# Altium schematic sheet Digital_Testbed.SchDoc
size A4; SheetNumber: 1; SheetTotal: 4
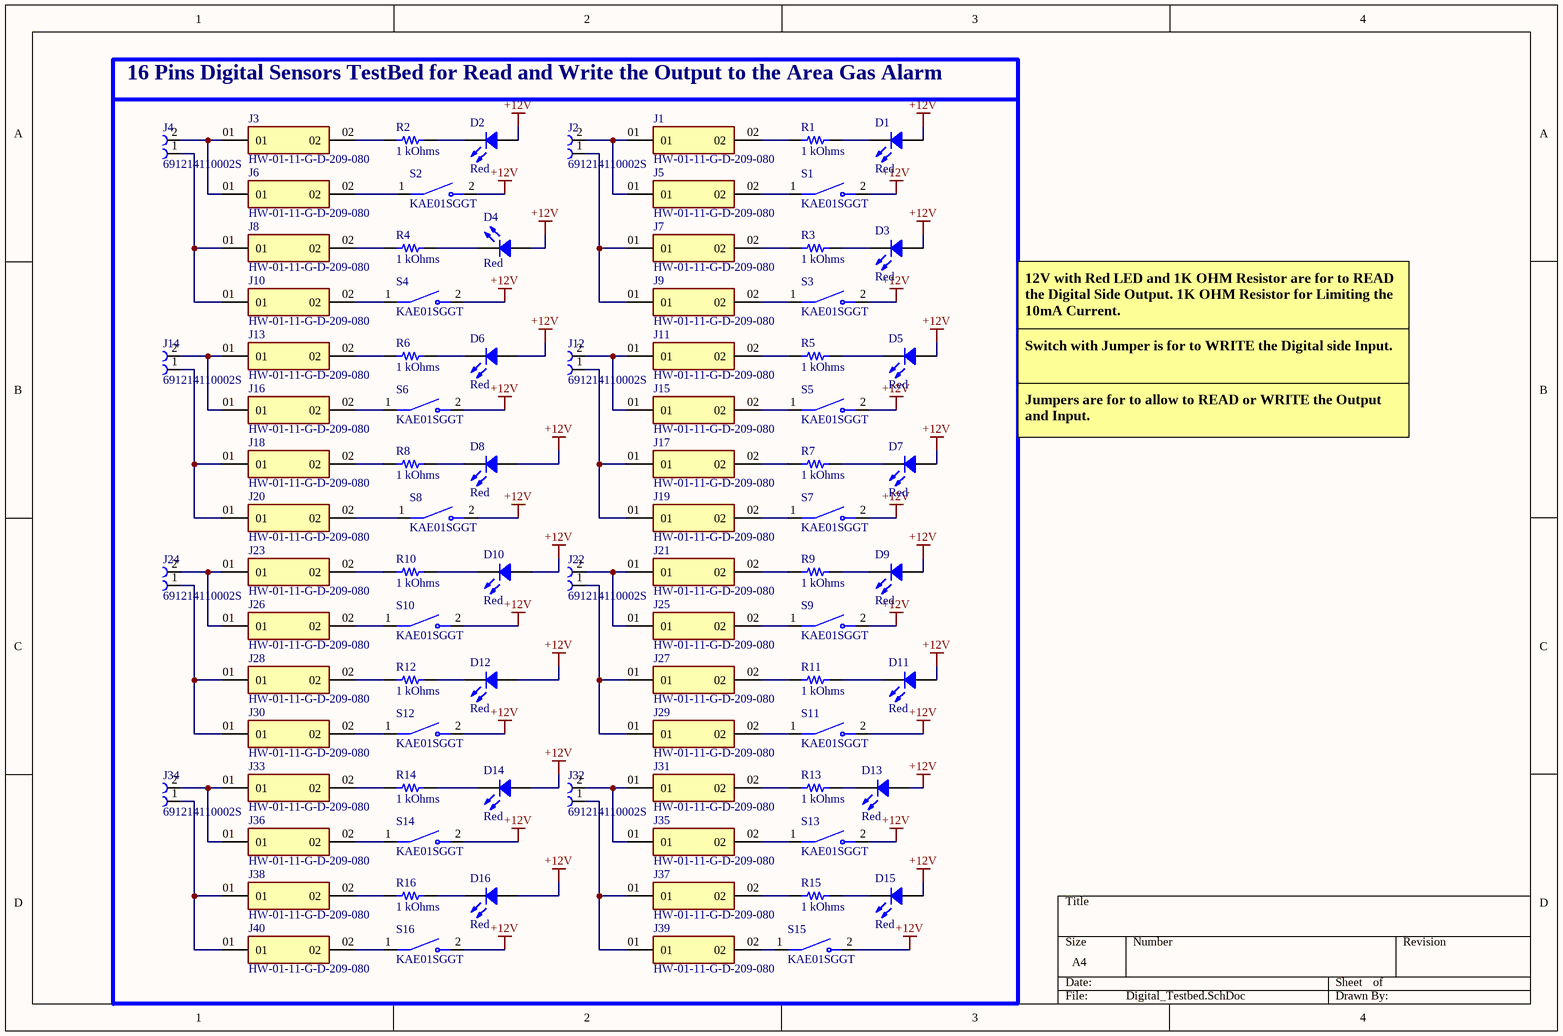
[diagram p0: Digital_Testbed.SchDoc]

## Parts
D1  Red  [LED 0603_1608 RED]
D2  Red  [LED 0603_1608 RED]
D3  Red  [LED 0603_1608 RED]
D4  Red  [LED 0603_1608 RED]
D5  Red  [LED 0603_1608 RED]
D6  Red  [LED 0603_1608 RED]
D7  Red  [LED 0603_1608 RED]
D8  Red  [LED 0603_1608 RED]
D9  Red  [LED 0603_1608 RED]
D10  Red  [LED 0603_1608 RED]
D11  Red  [LED 0603_1608 RED]
D12  Red  [LED 0603_1608 RED]
D13  Red  [LED 0603_1608 RED]
D14  Red  [LED 0603_1608 RED]
D15  Red  [LED 0603_1608 RED]
D16  Red  [LED 0603_1608 RED]
J1  HW-01-11-G-D-209-080  [SAMTEC_HW-01-11-G-D-209-080]
J2  691214110002S  [691214110002S]
J3  HW-01-11-G-D-209-080  [SAMTEC_HW-01-11-G-D-209-080]
J4  691214110002S  [691214110002S]
J5  HW-01-11-G-D-209-080  [SAMTEC_HW-01-11-G-D-209-080]
J6  HW-01-11-G-D-209-080  [SAMTEC_HW-01-11-G-D-209-080]
J7  HW-01-11-G-D-209-080  [SAMTEC_HW-01-11-G-D-209-080]
J8  HW-01-11-G-D-209-080  [SAMTEC_HW-01-11-G-D-209-080]
J9  HW-01-11-G-D-209-080  [SAMTEC_HW-01-11-G-D-209-080]
J10  HW-01-11-G-D-209-080  [SAMTEC_HW-01-11-G-D-209-080]
J11  HW-01-11-G-D-209-080  [SAMTEC_HW-01-11-G-D-209-080]
J12  691214110002S  [691214110002S]
J13  HW-01-11-G-D-209-080  [SAMTEC_HW-01-11-G-D-209-080]
J14  691214110002S  [691214110002S]
J15  HW-01-11-G-D-209-080  [SAMTEC_HW-01-11-G-D-209-080]
J16  HW-01-11-G-D-209-080  [SAMTEC_HW-01-11-G-D-209-080]
J17  HW-01-11-G-D-209-080  [SAMTEC_HW-01-11-G-D-209-080]
J18  HW-01-11-G-D-209-080  [SAMTEC_HW-01-11-G-D-209-080]
J19  HW-01-11-G-D-209-080  [SAMTEC_HW-01-11-G-D-209-080]
J20  HW-01-11-G-D-209-080  [SAMTEC_HW-01-11-G-D-209-080]
J21  HW-01-11-G-D-209-080  [SAMTEC_HW-01-11-G-D-209-080]
J22  691214110002S  [691214110002S]
J23  HW-01-11-G-D-209-080  [SAMTEC_HW-01-11-G-D-209-080]
J24  691214110002S  [691214110002S]
J25  HW-01-11-G-D-209-080  [SAMTEC_HW-01-11-G-D-209-080]
J26  HW-01-11-G-D-209-080  [SAMTEC_HW-01-11-G-D-209-080]
J27  HW-01-11-G-D-209-080  [SAMTEC_HW-01-11-G-D-209-080]
J28  HW-01-11-G-D-209-080  [SAMTEC_HW-01-11-G-D-209-080]
J29  HW-01-11-G-D-209-080  [SAMTEC_HW-01-11-G-D-209-080]
J30  HW-01-11-G-D-209-080  [SAMTEC_HW-01-11-G-D-209-080]
J31  HW-01-11-G-D-209-080  [SAMTEC_HW-01-11-G-D-209-080]
J32  691214110002S  [691214110002S]
J33  HW-01-11-G-D-209-080  [SAMTEC_HW-01-11-G-D-209-080]
J34  691214110002S  [691214110002S]
J35  HW-01-11-G-D-209-080  [SAMTEC_HW-01-11-G-D-209-080]
J36  HW-01-11-G-D-209-080  [SAMTEC_HW-01-11-G-D-209-080]
J37  HW-01-11-G-D-209-080  [SAMTEC_HW-01-11-G-D-209-080]
J38  HW-01-11-G-D-209-080  [SAMTEC_HW-01-11-G-D-209-080]
J39  HW-01-11-G-D-209-080  [SAMTEC_HW-01-11-G-D-209-080]
J40  HW-01-11-G-D-209-080  [SAMTEC_HW-01-11-G-D-209-080]
R1  1 kOhms  [RES 0603_1608]
R2  1 kOhms  [RES 0603_1608]
R3  1 kOhms  [RES 0603_1608]
R4  1 kOhms  [RES 0603_1608]
R5  1 kOhms  [RES 0603_1608]
R6  1 kOhms  [RES 0603_1608]
R7  1 kOhms  [RES 0603_1608]
R8  1 kOhms  [RES 0603_1608]
R9  1 kOhms  [RES 0603_1608]
R10  1 kOhms  [RES 0603_1608]
R11  1 kOhms  [RES 0603_1608]
R12  1 kOhms  [RES 0603_1608]
R13  1 kOhms  [RES 0603_1608]
R14  1 kOhms  [RES 0603_1608]
R15  1 kOhms  [RES 0603_1608]
R16  1 kOhms  [RES 0603_1608]
S1  KAE01SGGT  [SW_KAE01SGGT]
S2  KAE01SGGT  [SW_KAE01SGGT]
S3  KAE01SGGT  [SW_KAE01SGGT]
S4  KAE01SGGT  [SW_KAE01SGGT]
S5  KAE01SGGT  [SW_KAE01SGGT]
S6  KAE01SGGT  [SW_KAE01SGGT]
S7  KAE01SGGT  [SW_KAE01SGGT]
S8  KAE01SGGT  [SW_KAE01SGGT]
S9  KAE01SGGT  [SW_KAE01SGGT]
S10  KAE01SGGT  [SW_KAE01SGGT]
S11  KAE01SGGT  [SW_KAE01SGGT]
S12  KAE01SGGT  [SW_KAE01SGGT]
S13  KAE01SGGT  [SW_KAE01SGGT]
S14  KAE01SGGT  [SW_KAE01SGGT]
S15  KAE01SGGT  [SW_KAE01SGGT]
S16  KAE01SGGT  [SW_KAE01SGGT]

## Nets
+12V: D1.1 D2.1 D3.1 D4.1 D5.1 D6.1 D7.1 D8.1 D9.1 D10.1 D11.1 D12.1 D13.1 D14.1 D15.1 D16.1 S1.2 S2.2 S3.2 S4.2 S5.2 S6.2 S7.2 S8.2 S9.2 S10.2 S11.2 S12.2 S13.2 S14.2 S15.2 S16.2
NetD1_2: D1.2 R1.2
NetD2_2: D2.2 R2.2
NetD3_2: D3.2 R3.2
NetD4_2: D4.2 R4.2
NetD5_2: D5.2 R5.2
NetD6_2: D6.2 R6.2
NetD7_2: D7.2 R7.2
NetD8_2: D8.2 R8.2
NetD9_2: D9.2 R9.2
NetD10_2: D10.2 R10.2
NetD11_2: D11.2 R11.2
NetD12_2: D12.2 R12.2
NetD13_2: D13.2 R13.2
NetD14_2: D14.2 R14.2
NetD15_2: D15.2 R15.2
NetD16_2: D16.2 R16.2
NetJ1_01: J1.01 J2.2 J5.01
NetJ1_02: J1.02 R1.1
NetJ2_1: J2.1 J7.01 J9.01
NetJ3_01: J3.01 J4.2 J6.01
NetJ3_02: J3.02 R2.1
NetJ4_1: J4.1 J8.01 J10.01
NetJ5_02: J5.02 S1.1
NetJ6_02: J6.02 S2.1
NetJ7_02: J7.02 R3.1
NetJ8_02: J8.02 R4.1
NetJ9_02: J9.02 S3.1
NetJ10_02: J10.02 S4.1
NetJ11_01: J11.01 J12.2 J15.01
NetJ11_02: J11.02 R5.1
NetJ12_1: J12.1 J17.01 J19.01
NetJ13_01: J13.01 J14.2 J16.01
NetJ13_02: J13.02 R6.1
NetJ14_1: J14.1 J18.01 J20.01
NetJ15_02: J15.02 S5.1
NetJ16_02: J16.02 S6.1
NetJ17_02: J17.02 R7.1
NetJ18_02: J18.02 R8.1
NetJ19_02: J19.02 S7.1
NetJ20_02: J20.02 S8.1
NetJ21_01: J21.01 J22.2 J25.01
NetJ21_02: J21.02 R9.1
NetJ22_1: J22.1 J27.01 J29.01
NetJ23_01: J23.01 J24.2 J26.01
NetJ23_02: J23.02 R10.1
NetJ24_1: J24.1 J28.01 J30.01
NetJ25_02: J25.02 S9.1
NetJ26_02: J26.02 S10.1
NetJ27_02: J27.02 R11.1
NetJ28_02: J28.02 R12.1
NetJ29_02: J29.02 S11.1
NetJ30_02: J30.02 S12.1
NetJ31_01: J31.01 J32.2 J35.01
NetJ31_02: J31.02 R13.1
NetJ32_1: J32.1 J37.01 J39.01
NetJ33_01: J33.01 J34.2 J36.01
NetJ33_02: J33.02 R14.1
NetJ34_1: J34.1 J38.01 J40.01
NetJ35_02: J35.02 S13.1
NetJ36_02: J36.02 S14.1
NetJ37_02: J37.02 R15.1
NetJ38_02: J38.02 R16.1
NetJ39_02: J39.02 S15.1
NetJ40_02: J40.02 S16.1

## Notes on the sheet
- 16 Pins Digital Sensors TestBed for Read and Write the Output to the Area Gas Alarm
- 12V with Red LED and 1K OHM Resistor are for to READ the Digital Side Output. 1K OHM Resistor for Limiting the 10mA Current.
- Switch with Jumper is for to WRITE the Digital side Input.
- Jumpers are for to allow to READ or WRITE the Output and Input.

## Library data of the parts
D1-D16 = 19-213SDRC/S259/TR8: LED RED CLEAR 2SMD; Manufacturer: Everlight Electronics Co Ltd; Configuration: Standard; Current - Test: 10mA; Lens Color: Colorless; Lens Size: 1.20mm x 0.80mm; Lens Style: Rectangle with Flat Top; Viewing Angle: 120°; Voltage - Forward (Vf) (Typ): 2V; Wavelength - Peak: 650nm; Part Number: 19-213SDRC/S259/TR8; Color: Red; ComponentLink1Description: Datasheet; ComponentLink1URL: //media.digikey.com/pdf/Data%20Sheets/Everlight%20PDFs/19-213SDRC-S259-TR8.pdf; ComponentLink2Description: DigiKey Link; ComponentLink2URL: http://digikey.com/product-detail/en/everlight-electronics-co-ltd/19-213SDRC-S259-TR8/1080-1580-1-ND/8535303; Device Package: 0603 (1608 Metric); Height (Max): 0.70mm; LastUpdated: 08/03/2023 8:58:11 pm; Lens Transparency: Clear; Lifecycle Status: Active; Minimum Order: 1; Mounting Type: Surface Mount; Package / Case: 0603 (1608 Metric); Packaging: TapeAndReel; PartId: 372; Part Status: Active; Price: 0.06; Series: -; Size / Dimension: 1.60mm L x 0.80mm W; Supplier 1: DigiKey; Supplier Part Number 1: 1080-1580-1-ND; Supplier Device Package: 2-SMD; Value: Red
J1 J3 J5-J11 J13 J15-J21 J23 J25-J31 J33 J35-J40 = HW-01-11-G-D-209-080: CONN HDR 2POS STACK T/H; MF: Samtec; Purchase-URL: https://pricing.snapeda.com/search/part/HW-01-11-G-D-209-080/?ref=eda; Value: *; Package: None; Check_prices: https://www.snapeda.com/parts/HW-01-11-G-D-209-080/Samtec/view-part/?ref=eda; Price: None; MP: HW-01-11-G-D-209-080; Availability: In Stock; SnapEDA_Link: https://www.snapeda.com/parts/HW-01-11-G-D-209-080/Samtec/view-part/?ref=snap
J2 J4 J12 J14 J22 J24 J32 J34 = 691214110002S: 2 Position Wire to Board Terminal Block Horizontal with Board 0.138 (3.50mm) Through Hole; MF: WÃ¼rth Elektronik; Check_prices: https://www.snapeda.com/parts/691214110002S/Wurth+Elektronik/view-part/?ref=eda; Availability: In Stock; Price: None; Package: None; Value: *; SnapEDA_Link: https://www.snapeda.com/parts/691214110002S/Wurth+Elektronik/view-part/?ref=snap; MP: 691214110002S; Purchase-URL: https://pricing.snapeda.com/search/part/691214110002S/?ref=eda
R1-R16 = CPF0603B1K0E: RES SMD 1K OHM 0.1% 1/16W 0603; Manufacturer: TE Connectivity Passive Product; Power (Watts): 0.063W, 1/16W; Temperature Coefficient: ±25ppm/°C; Part Number: CPF0603B1K0E; Value: 1 kOhms; ComponentLink1Description: Datasheet; ComponentLink1URL: https://www.te.com/commerce/DocumentDelivery/DDEController?Action=srchrtrv&DocNm=1773200&DocType=DS&DocLang=English; ComponentLink2Description: DigiKey Link; ComponentLink2URL: https://www.digikey.com/en/products/detail/te-connectivity-passive-product/CPF0603B1K0E/2390473; Composition: Thin Film; Device Package: 0603 (1608 Metric); Height - Seated (Max): 0.022" (0.55mm); LastUpdated: 08/03/2023 8:30:18 pm; Lifecycle Status: Active; Minimum Order: 1; Number of Terminations: 2; Operating Temperature: -55°C ~ 155°C; Package / Case: 0603 (1608 Metric); Packaging: TapeAndReel; PartId: 4877; Part Status: Active; Price: 0.09; Resistance: 1 kOhms; Series: CPF, Neohm; Size / Dimension: 0.061" L x 0.031" W (1.55mm x 0.80mm); Supplier 1: DigiKey; Supplier Part Number 1: A119887CT-ND; Supplier Device Package: 0603; Tolerance: ±0.1%
S1-S16 = KAE01SGGT: Dip Switch SPST 1 Position Surface Mount Slide (Standard) Actuator 25mA 24VDC; MF: E-Switch; Check_prices: https://www.snapeda.com/parts/KAE01SGGT/E-Switch/view-part/?ref=eda; Value: *; Availability: In Stock; MP: KAE01SGGT; Price: None; Package: None; SnapEDA_Link: https://www.snapeda.com/parts/KAE01SGGT/E-Switch/view-part/?ref=snap; Purchase-URL: https://pricing.snapeda.com/search/part/KAE01SGGT/?ref=eda